# Altium schematic sheet MCP23017-5.SchDoc
size B
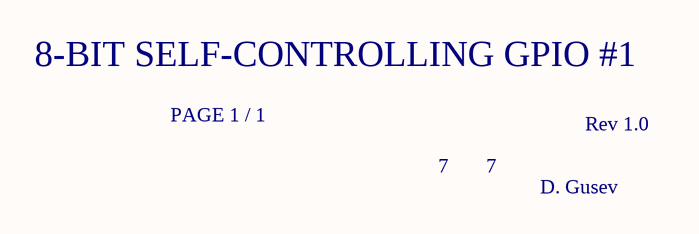
[diagram p0: MCP23017-5.SchDoc]

## Notes on the sheet
- 8-BIT SELF-CONTROLLING GPIO #1
- PAGE 1 / 1
- 7
- Rev 1.0
- D. Gusev